# Altium project LF.FreeFlight.PrjPCB
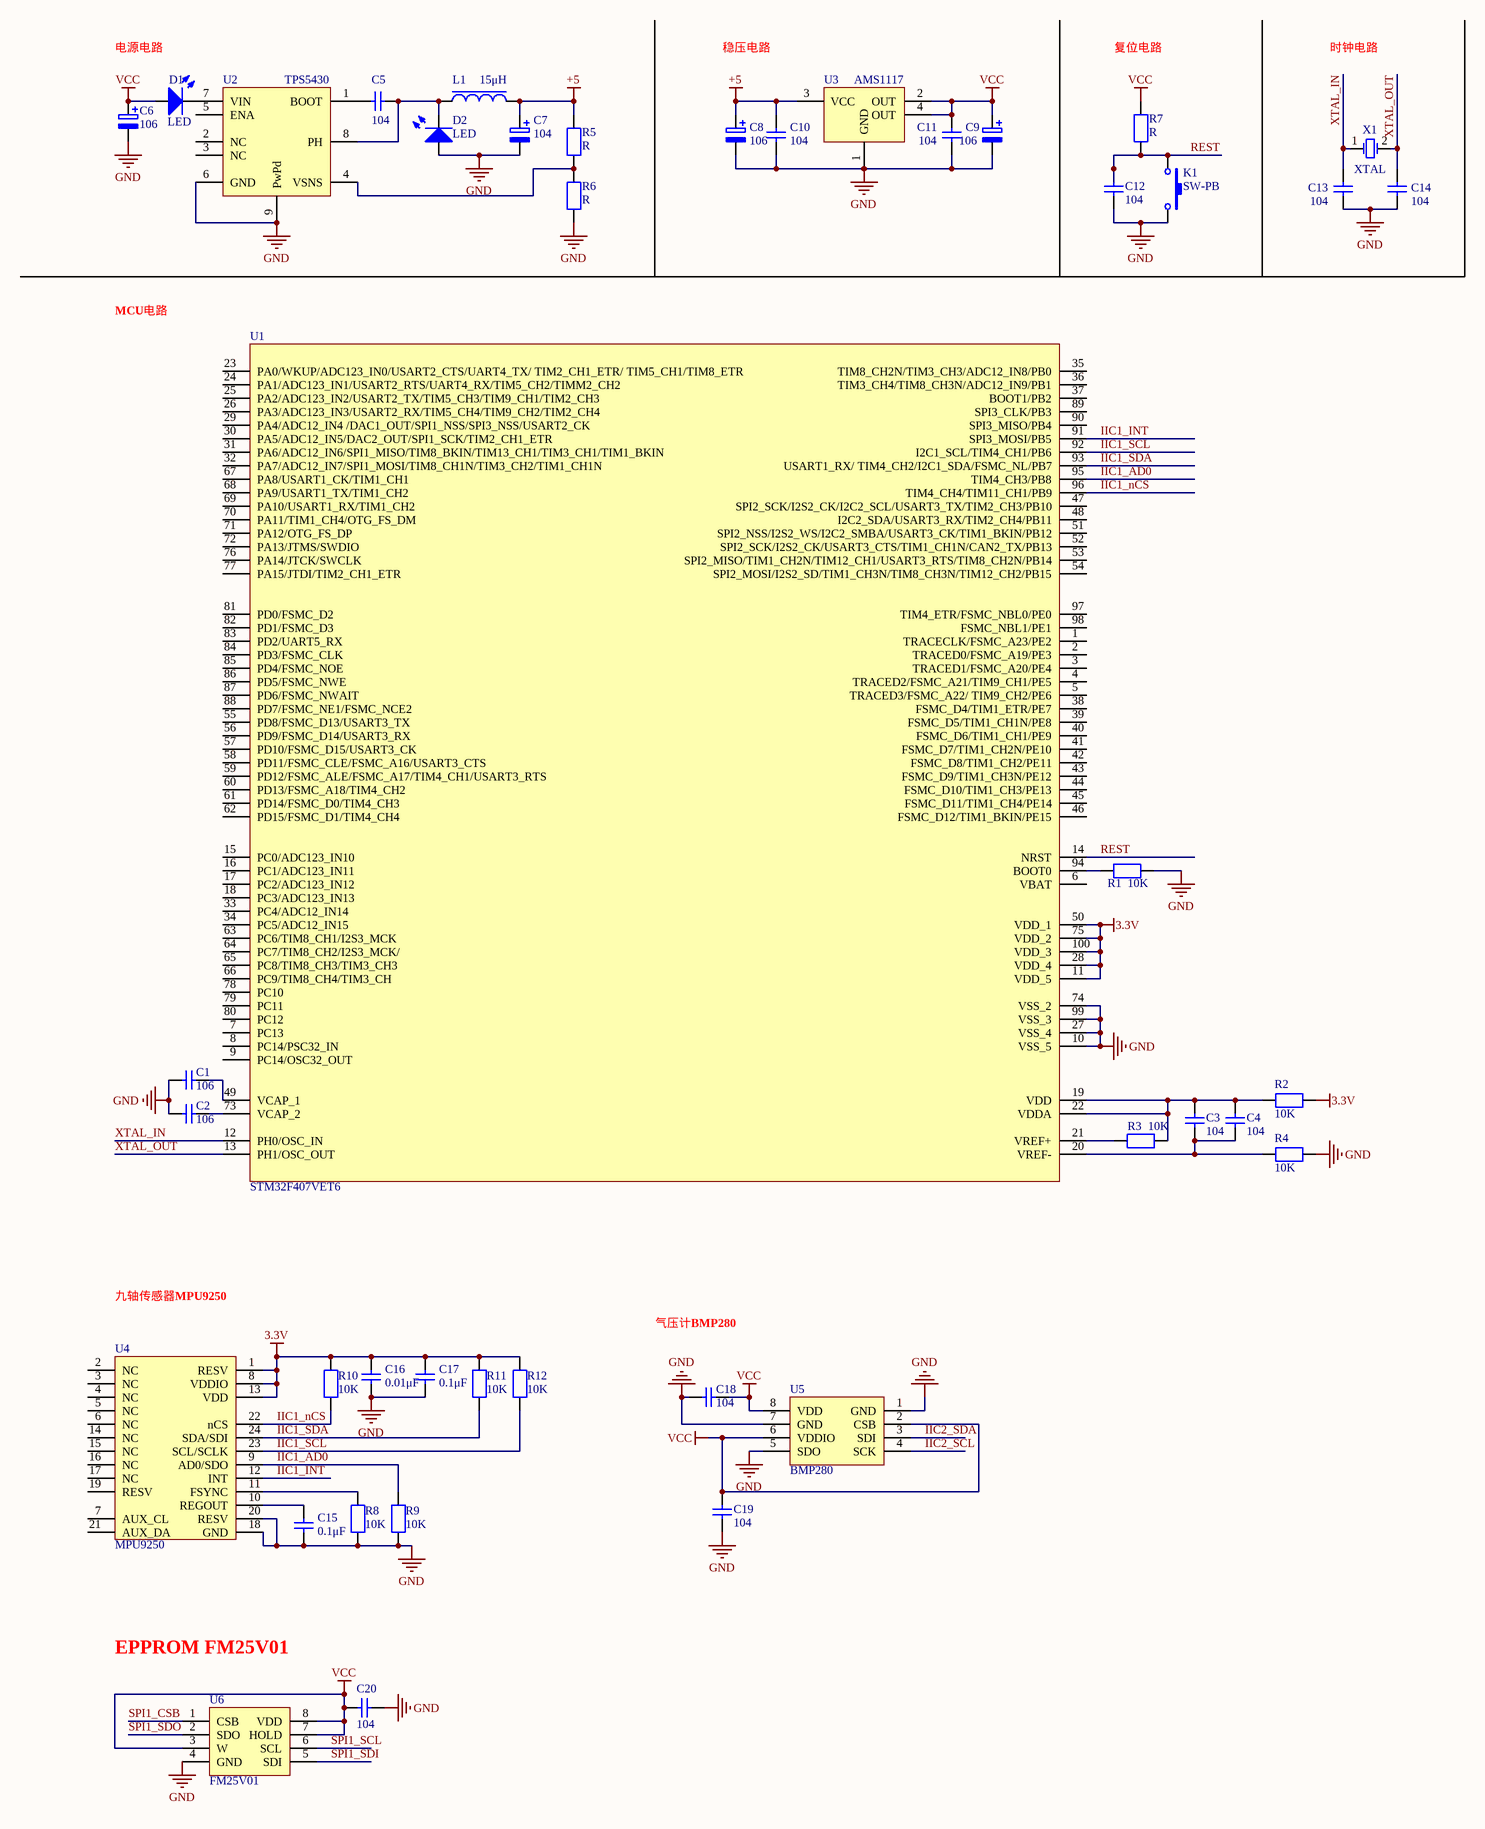
[diagram p0: LFFF.SchDoc]
1 sheet, 43 parts. Net scope: global (net labels, ports and power ports of the same name join across sheets).
Board file: LFFF.PcbDoc

## Sheet LFFF.SchDoc: LFIF
size A2

### Parts
C1  106  [RC0805]
C2  106  [RC0805]
C3  104  [RC0805]
C4  104  [RC0805]
C5  104  [RC0805]
C6  106  [RC0805]
C7  104  [RC0805]
C8  106  [RC0805]
C9  106  [RC0805]
C10  104  [RC0805]
C11  104  [RC0805]
C12  104  [RC0805]
C13  104  [RC0805]
C14  104  [RC0805]
C15  0.1μF  [RC0805]
C16  0.01μF  [RC0805]
C17  0.1μF  [RC0805]
C18  104  [RC0805]
C19  104  [RC0805]
C20  104  [RC0805]
D1  LED  [LED]  (graphical)
D2  LED  [LED]
K1  SW-PB  [SW-PB]
L1  15μH  [CD45]
R1  10K  [RC0805]
R2  10K  [RC0805]
R3  10K  [RC0805]
R4  10K  [RC0805]
R5  R  [RC0805]
R6  R  [RC0805]
R7  R  [RC0805]
R8  10K  [RC0805]
R9  10K  [RC0805]
R10  10K  [RC0805]
R11  10K  [RC0805]
R12  10K  [RC0805]
U1  STM32F407VET6  [STM32F407VET6]
U2  TPS5430  [TPS5430]
U3  AMS1117  [AMS1117]
U4  MPU9250  [MPU9250]
U5  BMP280
U6  FM25V01  [FM25V01]
X1  XTAL  [49S-SMD]

### Nets
3.3V: C16.2 C17.2 R2.2 R10.2 R11.2 R12.2 U1.11(VDD_5) U1.28(VDD_4) U1.50(VDD_1) U1.75(VDD_2) U1.100(VDD_3) U4.1(RESV) U4.8(VDDIO) U4.13(VDD)
+5: C7.1 C8.1 C10.1 L1.2 R5.2 U3.3(VCC)
GND: C1.1 C2.1 C6.2 C7.2 C8.2 C9.2 C10.2 C11.2 C12.1 C13.1 C14.1 C15.1 C16.1 C17.1 C18.1 C19.1 C20.2 D2.1 K1.2 R1.2 R4.2 R6.1 R8.1 R9.1 U1.10(VSS_5) U1.27(VSS_4) U1.74(VSS_2) U1.99(VSS_3) U2.6(GND) U2.9(PwPd) U3.1(GND) U4.18(GND) U4.20(RESV) U5.1(GND) U5.5(SDO) U5.7(GND) U6.4(GND)
VCC: C6.1 C9.1 C11.1 C18.2 C19.2 C20.1 D1.1 R7.2 U3.2(OUT) U3.4(OUT) U5.2(CSB) U5.6(VDDIO) U5.8(VDD) U6.3(W) U6.7(HOLD) U6.8(VDD)
IIC1_AD0: R9.2 U1.95(TIM4_CH3/PB8) U4.9(AD0/SDO)
IIC1_INT: U1.91(SPI3_MOSI/PB5) U4.12(INT)
IIC1_nCS: R10.1 U1.96(TIM4_CH4/TIM11_CH1/PB9) U4.22(nCS)
IIC1_SCL: R12.1 U1.92(I2C1_SCL/TIM4_CH1/PB6) U4.23(SCL/SCLK)
IIC1_SDA: R11.1 U1.93(USART1_RX/_TIM4_CH2/I2C1_SDA/FSMC_NL/PB7) U4.24(SDA/SDI)
IIC2_SCL: U5.4(SCK)
IIC2_SDA: U5.3(SDI)
REST: C12.2 K1.1 R7.1 U1.14(NRST)
SPI1_CSB: U6.1(CSB)
SPI1_SCL: U6.6(SCL)
SPI1_SDI: U6.5(SDI)
SPI1_SDO: U6.2(SDO)
XTAL_IN: C13.2 U1.12(PH0/OSC_IN) X1.1(IN)
XTAL_OUT: C14.2 U1.13(PH1/OSC_OUT) X1.2(OUT)
NetC1_2: C1.2 U1.49(VCAP_1)
NetC2_2: C2.2 U1.73(VCAP_2)
NetC3_1: C3.1 C4.1 R4.1 U1.20(VREF-)
NetC3_2: C3.2 C4.2 R2.1 R3.2 U1.19(VDD) U1.22(VDDA)
NetC5_1: C5.1 U2.1(BOOT)
NetC5_2: C5.2 D2.2 L1.1 U2.8(PH)
NetC15_2: C15.2 U4.10(REGOUT)
NetD1_2: D1.2 U2.7(VIN)
NetR1_1: R1.1 U1.94(BOOT0)
NetR3_1: R3.1 U1.21(VREF+)
NetR5_1: R5.1 R6.2 U2.4(VSNS)
NetR8_2: R8.2 U4.11(FSYNC)

Not connected (* = marked no-connect by the designer): U1 1(TRACECLK/FSMC_A23/PE2) 2(TRACED0/FSMC_A19/PE3) 3(TRACED1/FSMC_A20/PE4) 4(TRACED2/FSMC_A21/TIM9_CH1/PE5) 5(TRACED3/FSMC_A22/_TIM9_CH2/PE6) 6(VBAT) 7(PC13) 8(PC14/PSC32_IN) 9(PC14/OSC32_OUT) 15(PC0/ADC123_IN10) 16(PC1/ADC123_IN11) 17(PC2/ADC123_IN12) 18(PC3/ADC123_IN13) 23(PA0/WKUP/ADC123_IN0/USART2_CTS/UART4_TX/_TIM2_CH1_ETR/_TIM5_CH1/TIM8_ETR) 24(PA1/ADC123_IN1/USART2_RTS/UART4_RX/TIM5_CH2/TIMM2_CH2) 25(PA2/ADC123_IN2/USART2_TX/TIM5_CH3/TIM9_CH1/TIM2_CH3) 26(PA3/ADC123_IN3/USART2_RX/TIM5_CH4/TIM9_CH2/TIM2_CH4) 29(PA4/ADC12_IN4_/DAC1_OUT/SPI1_NSS/SPI3_NSS/USART2_CK) 30(PA5/ADC12_IN5/DAC2_OUT/SPI1_SCK/TIM2_CH1_ETR) 31(PA6/ADC12_IN6/SPI1_MISO/TIM8_BKIN/TIM13_CH1/TIM3_CH1/TIM1_BKIN) 32(PA7/ADC12_IN7/SPI1_MOSI/TIM8_CH1N/TIM3_CH2/TIM1_CH1N) 33(PC4/ADC12_IN14) 34(PC5/ADC12_IN15) 35(TIM8_CH2N/TIM3_CH3/ADC12_IN8/PB0) 36(TIM3_CH4/TIM8_CH3N/ADC12_IN9/PB1) 37(BOOT1/PB2) 38(FSMC_D4/TIM1_ETR/PE7) 39(FSMC_D5/TIM1_CH1N/PE8) 40(FSMC_D6/TIM1_CH1/PE9) 41(FSMC_D7/TIM1_CH2N/PE10) 42(FSMC_D8/TIM1_CH2/PE11) 43(FSMC_D9/TIM1_CH3N/PE12) 44(FSMC_D10/TIM1_CH3/PE13) 45(FSMC_D11/TIM1_CH4/PE14) 46(FSMC_D12/TIM1_BKIN/PE15) 47(SPI2_SCK/I2S2_CK/I2C2_SCL/USART3_TX/TIM2_CH3/PB10) 48(I2C2_SDA/USART3_RX/TIM2_CH4/PB11) 51(SPI2_NSS/I2S2_WS/I2C2_SMBA/USART3_CK/TIM1_BKIN/PB12) 52(SPI2_SCK/I2S2_CK/USART3_CTS/TIM1_CH1N/CAN2_TX/PB13) 53(SPI2_MISO/TIM1_CH2N/TIM12_CH1/USART3_RTS/TIM8_CH2N/PB14) 54(SPI2_MOSI/I2S2_SD/TIM1_CH3N/TIM8_CH3N/TIM12_CH2/PB15) 55(PD8/FSMC_D13/USART3_TX) 56(PD9/FSMC_D14/USART3_RX) 57(PD10/FSMC_D15/USART3_CK) 58(PD11/FSMC_CLE/FSMC_A16/USART3_CTS) 59(PD12/FSMC_ALE/FSMC_A17/TIM4_CH1/USART3_RTS) 60(PD13/FSMC_A18/TIM4_CH2) 61(PD14/FSMC_D0/TIM4_CH3) 62(PD15/FSMC_D1/TIM4_CH4) 63(PC6/TIM8_CH1/I2S3_MCK) 64(PC7/TIM8_CH2/I2S3_MCK/) 65(PC8/TIM8_CH3/TIM3_CH3) 66(PC9/TIM8_CH4/TIM3_CH) 67(PA8/USART1_CK/TIM1_CH1) 68(PA9/USART1_TX/TIM1_CH2) 69(PA10/USART1_RX/TIM1_CH2) 70(PA11/TIM1_CH4/OTG_FS_DM) 71(PA12/OTG_FS_DP) 72(PA13/JTMS/SWDIO) 76(PA14/JTCK/SWCLK) 77(PA15/JTDI/TIM2_CH1_ETR) 78(PC10) 79(PC11) 80(PC12) 81(PD0/FSMC_D2) 82(PD1/FSMC_D3) 83(PD2/UART5_RX) 84(PD3/FSMC_CLK) 85(PD4/FSMC_NOE) 86(PD5/FSMC_NWE) 87(PD6/FSMC_NWAIT) 88(PD7/FSMC_NE1/FSMC_NCE2) 89(SPI3_CLK/PB3) 90(SPI3_MISO/PB4) 97(TIM4_ETR/FSMC_NBL0/PE0) 98(FSMC_NBL1/PE1); U2 2(NC) 3(NC) 5(ENA); U4 2(NC) 3(NC) 4(NC) 5(NC) 6(NC) 7(AUX_CL) 14(NC) 15(NC) 16(NC) 17(NC) 19(RESV) 21(AUX_DA)

### Notes on the sheet
- 电源电路
- 稳压电路
- 复位电路
- 时钟电路
- MCU电路
- 九轴传感器MPU9250
- 气压计BMP280
- EPPROM FM25V01

### Library data of the parts
C1-C5 C10-C20 = C
C6-C9 = C pol
L1 = L
R1-R4 R8-R12 = R